# EAGLE design chiclet (EAGLE 9.6.2)

## Sheet 1 of 3
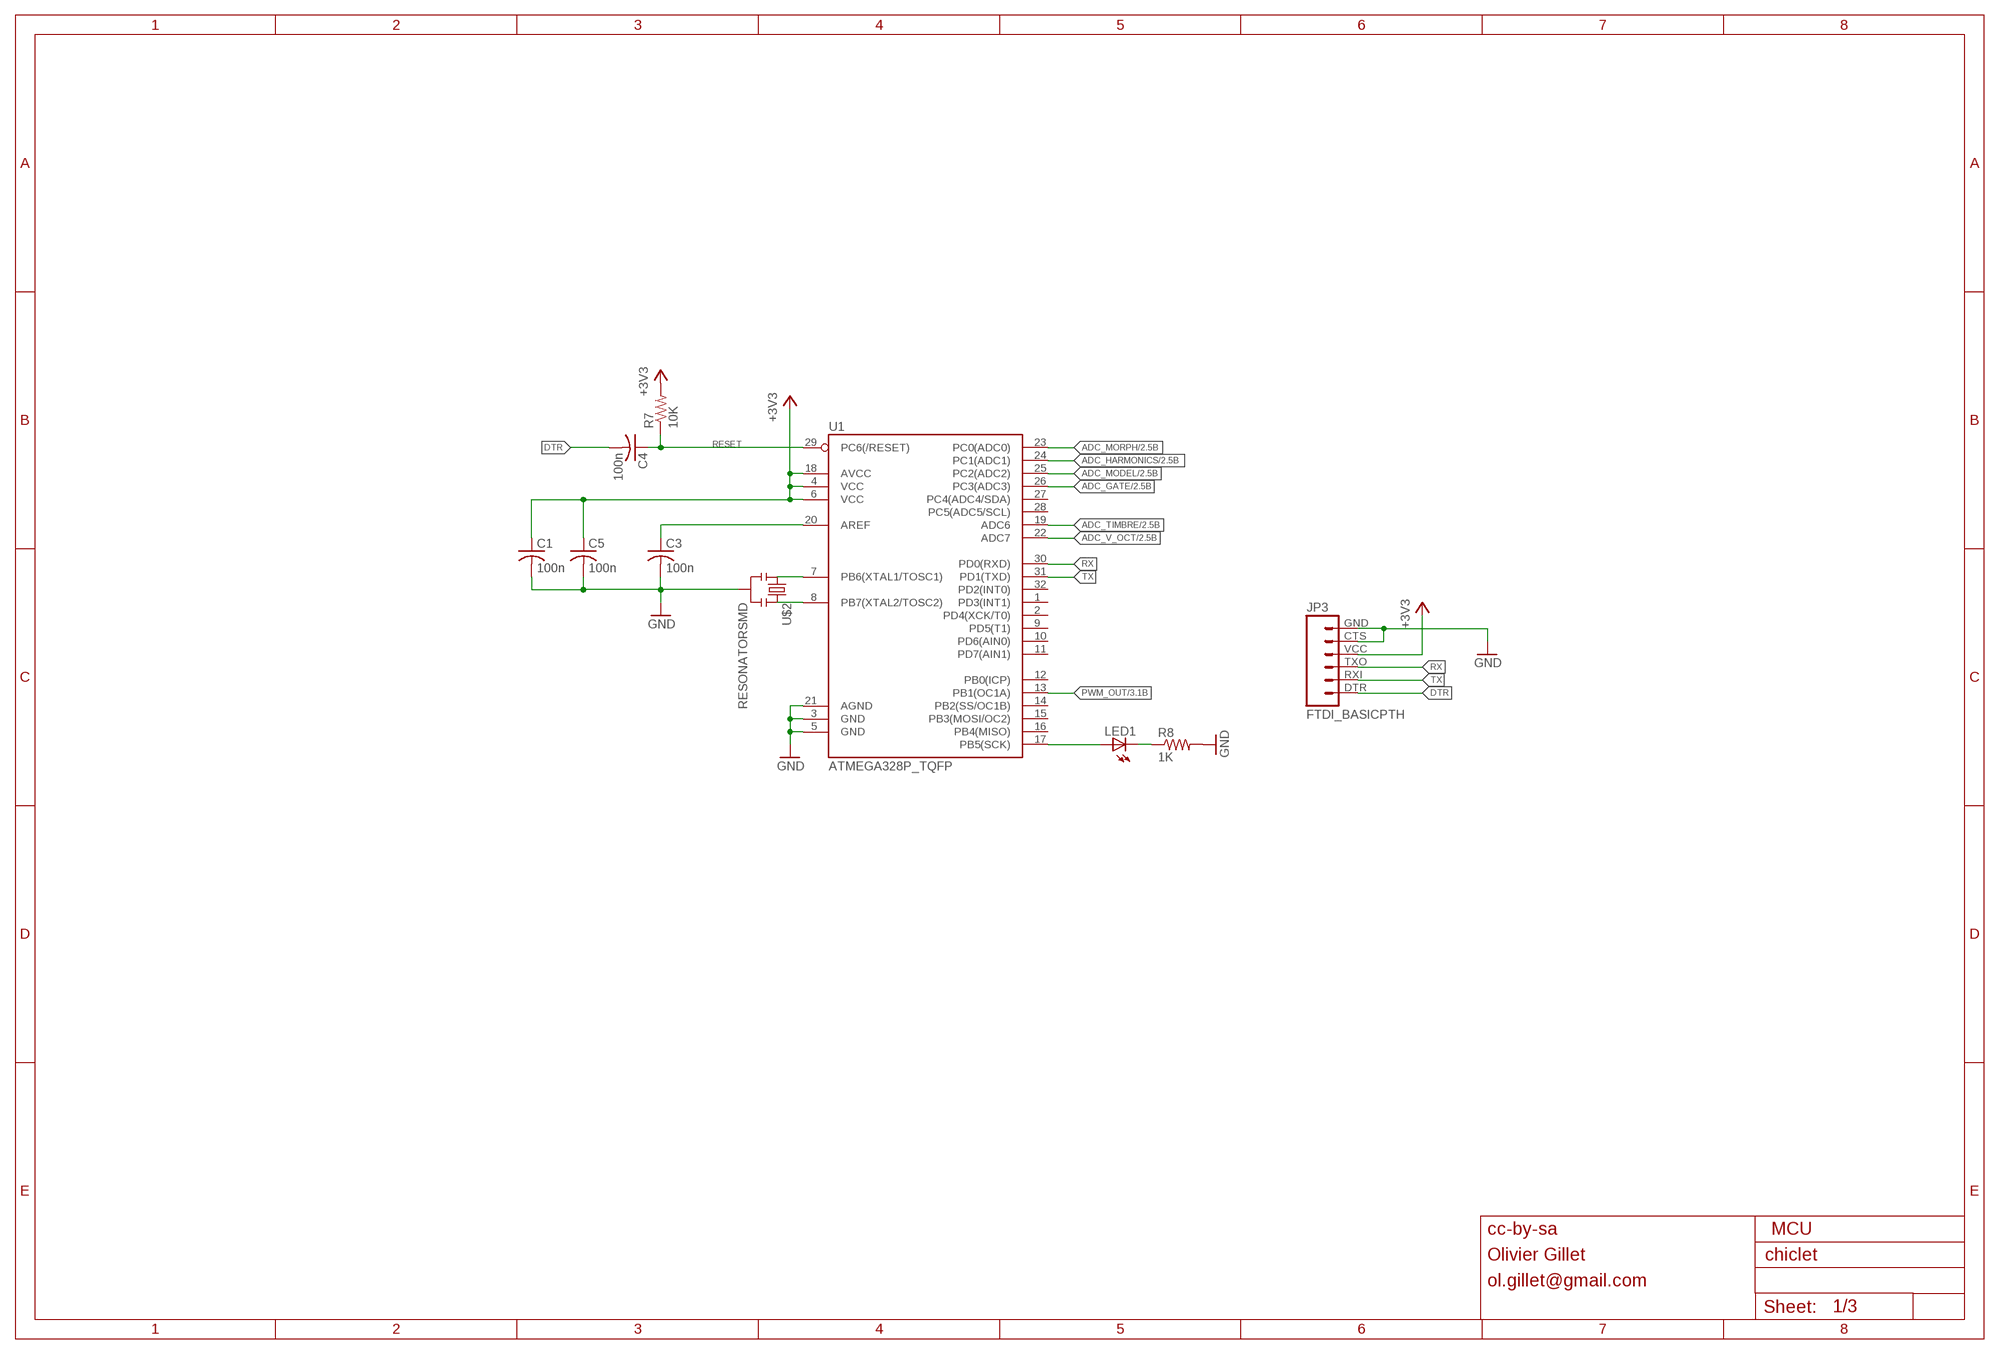
[diagram p0: schematic, sheet 1]

### Parts
C1  100n  C-USC0805  [C0805]
C3  100n  C-USC0805  [C0805]
C4  100n  C-USC0805  [C0805]
C5  100n  C-USC0805  [C0805]
JP3  FTDI_BASICPTH  [FTDI_BASIC]
LED1  LED-0805  [LED-805]
R7  10K  R-US_M0805  [M0805]
R8  1K  R-US_M0805  [M0805]
U1  ATMEGA328P_TQFP  [TQFP32-08]
U$2  RESONATORSMD  [RESONATOR-SMD]

### Nets
+3V3: C1.1 C5.1 JP3.VCC R7.2 U1.4(VCC) U1.6(VCC) U1.18(AVCC) ; also sheet 3
ADC_GATE: U1.26(PC3(ADC3)) ; also sheet 2
ADC_HARMONICS: U1.24(PC1(ADC1)) ; also sheet 2
ADC_MODEL: U1.25(PC2(ADC2)) ; also sheet 2
ADC_MORPH: U1.23(PC0(ADC0)) ; also sheet 2
ADC_TIMBRE: U1.19(ADC6) ; also sheet 2
ADC_V_OCT: U1.22(ADC7) ; also sheet 2
DTR: C4.2 JP3.DTR
GND: C1.2 C3.2 C5.2 JP3.CTS JP3.GND R8.2 U1.3(GND) U1.5(GND) U1.21(AGND) U$2.2 ; also sheet 3
N$1: U1.7(PB6(XTAL1/TOSC1)) U$2.1
N$2: U1.8(PB7(XTAL2/TOSC2)) U$2.3
N$3: C3.1 U1.20(AREF)
N$10: LED1.A U1.17(PB5(SCK))
N$12: LED1.C R8.1
PWM_OUT: U1.13(PB1(OC1A)) ; also sheet 3
RESET: C4.1 R7.1 U1.29(PC6(/RESET))
RX: JP3.TXO U1.30(PD0(RXD))
TX: JP3.RXI U1.31(PD1(TXD))
Unconnected: U1.1(PD3(INT1)) U1.2(PD4(XCK/T0)) U1.9(PD5(T1)) U1.10(PD6(AIN0)) U1.11(PD7(AIN1)) U1.12(PB0(ICP)) U1.14(PB2(SS/OC1B)) U1.15(PB3(MOSI/OC2)) U1.16(PB4(MISO)) U1.27(PC4(ADC4/SDA)) U1.28(PC5(ADC5/SCL)) U1.32(PD2(INT0))

### Notes on the sheet
- cc-by-sa | MCU
- Olivier Gillet
- ol.gillet@gmail.com

## Sheet 2 of 3
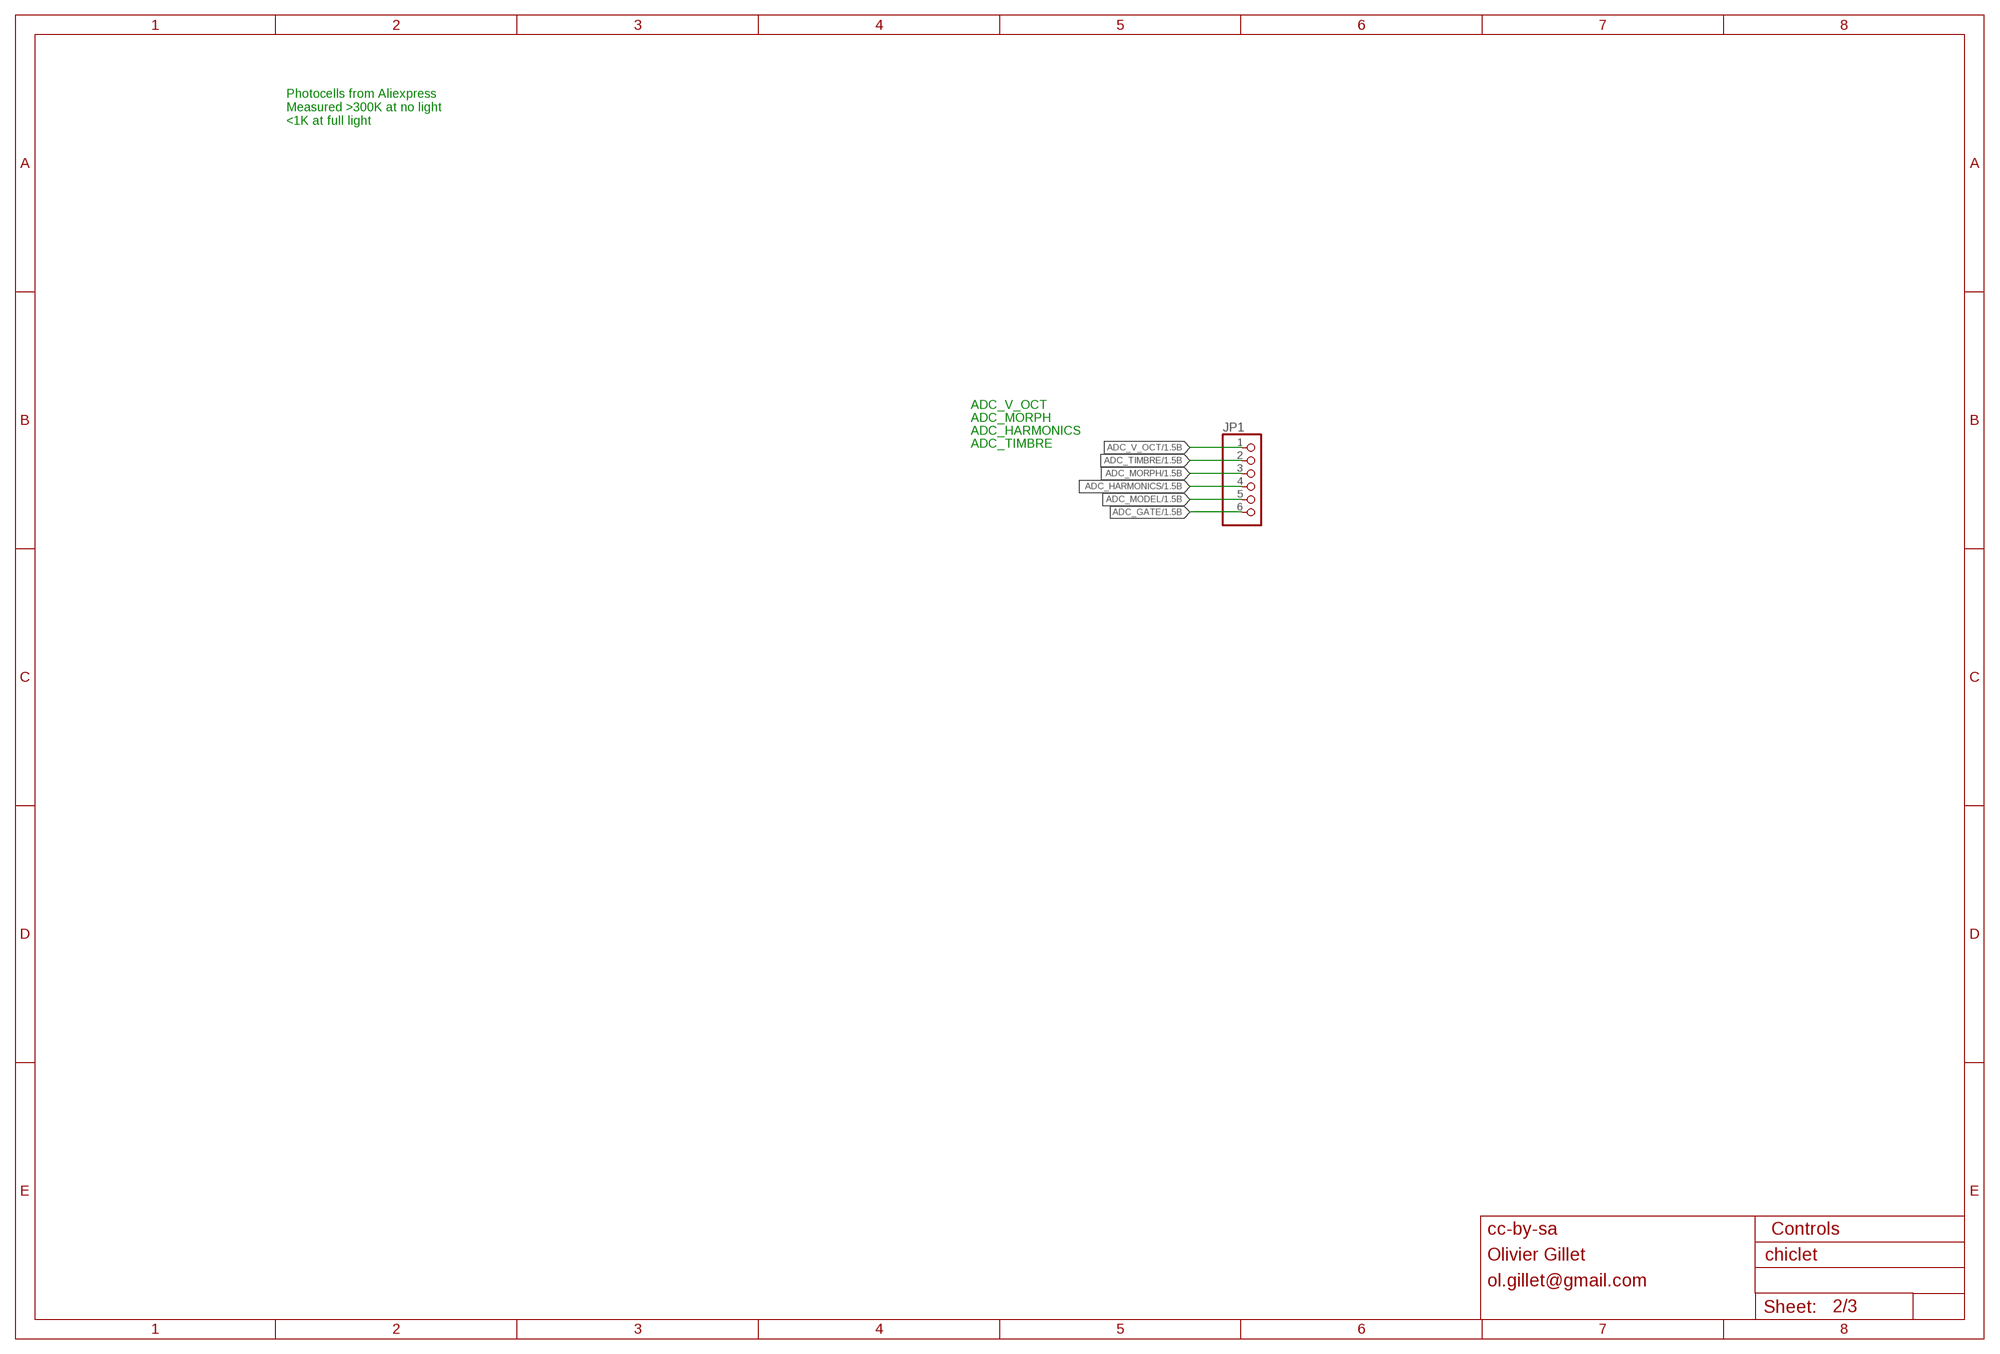
[diagram p1: schematic, sheet 2]

### Parts
JP1  PINHD-1X6  [1X06]

### Nets
ADC_GATE: JP1.6 ; also sheet 1
ADC_HARMONICS: JP1.4 ; also sheet 1
ADC_MODEL: JP1.5 ; also sheet 1
ADC_MORPH: JP1.3 ; also sheet 1
ADC_TIMBRE: JP1.2 ; also sheet 1
ADC_V_OCT: JP1.1 ; also sheet 1

### Notes on the sheet
- Photocells from Aliexpress
  Measured >300K at no light
  <1K at full light
- ADC_V_OCT
- ADC_MORPH
- ADC_HARMONICS
- ADC_TIMBRE
- cc-by-sa | Controls
- Olivier Gillet
- ol.gillet@gmail.com

## Sheet 3 of 3
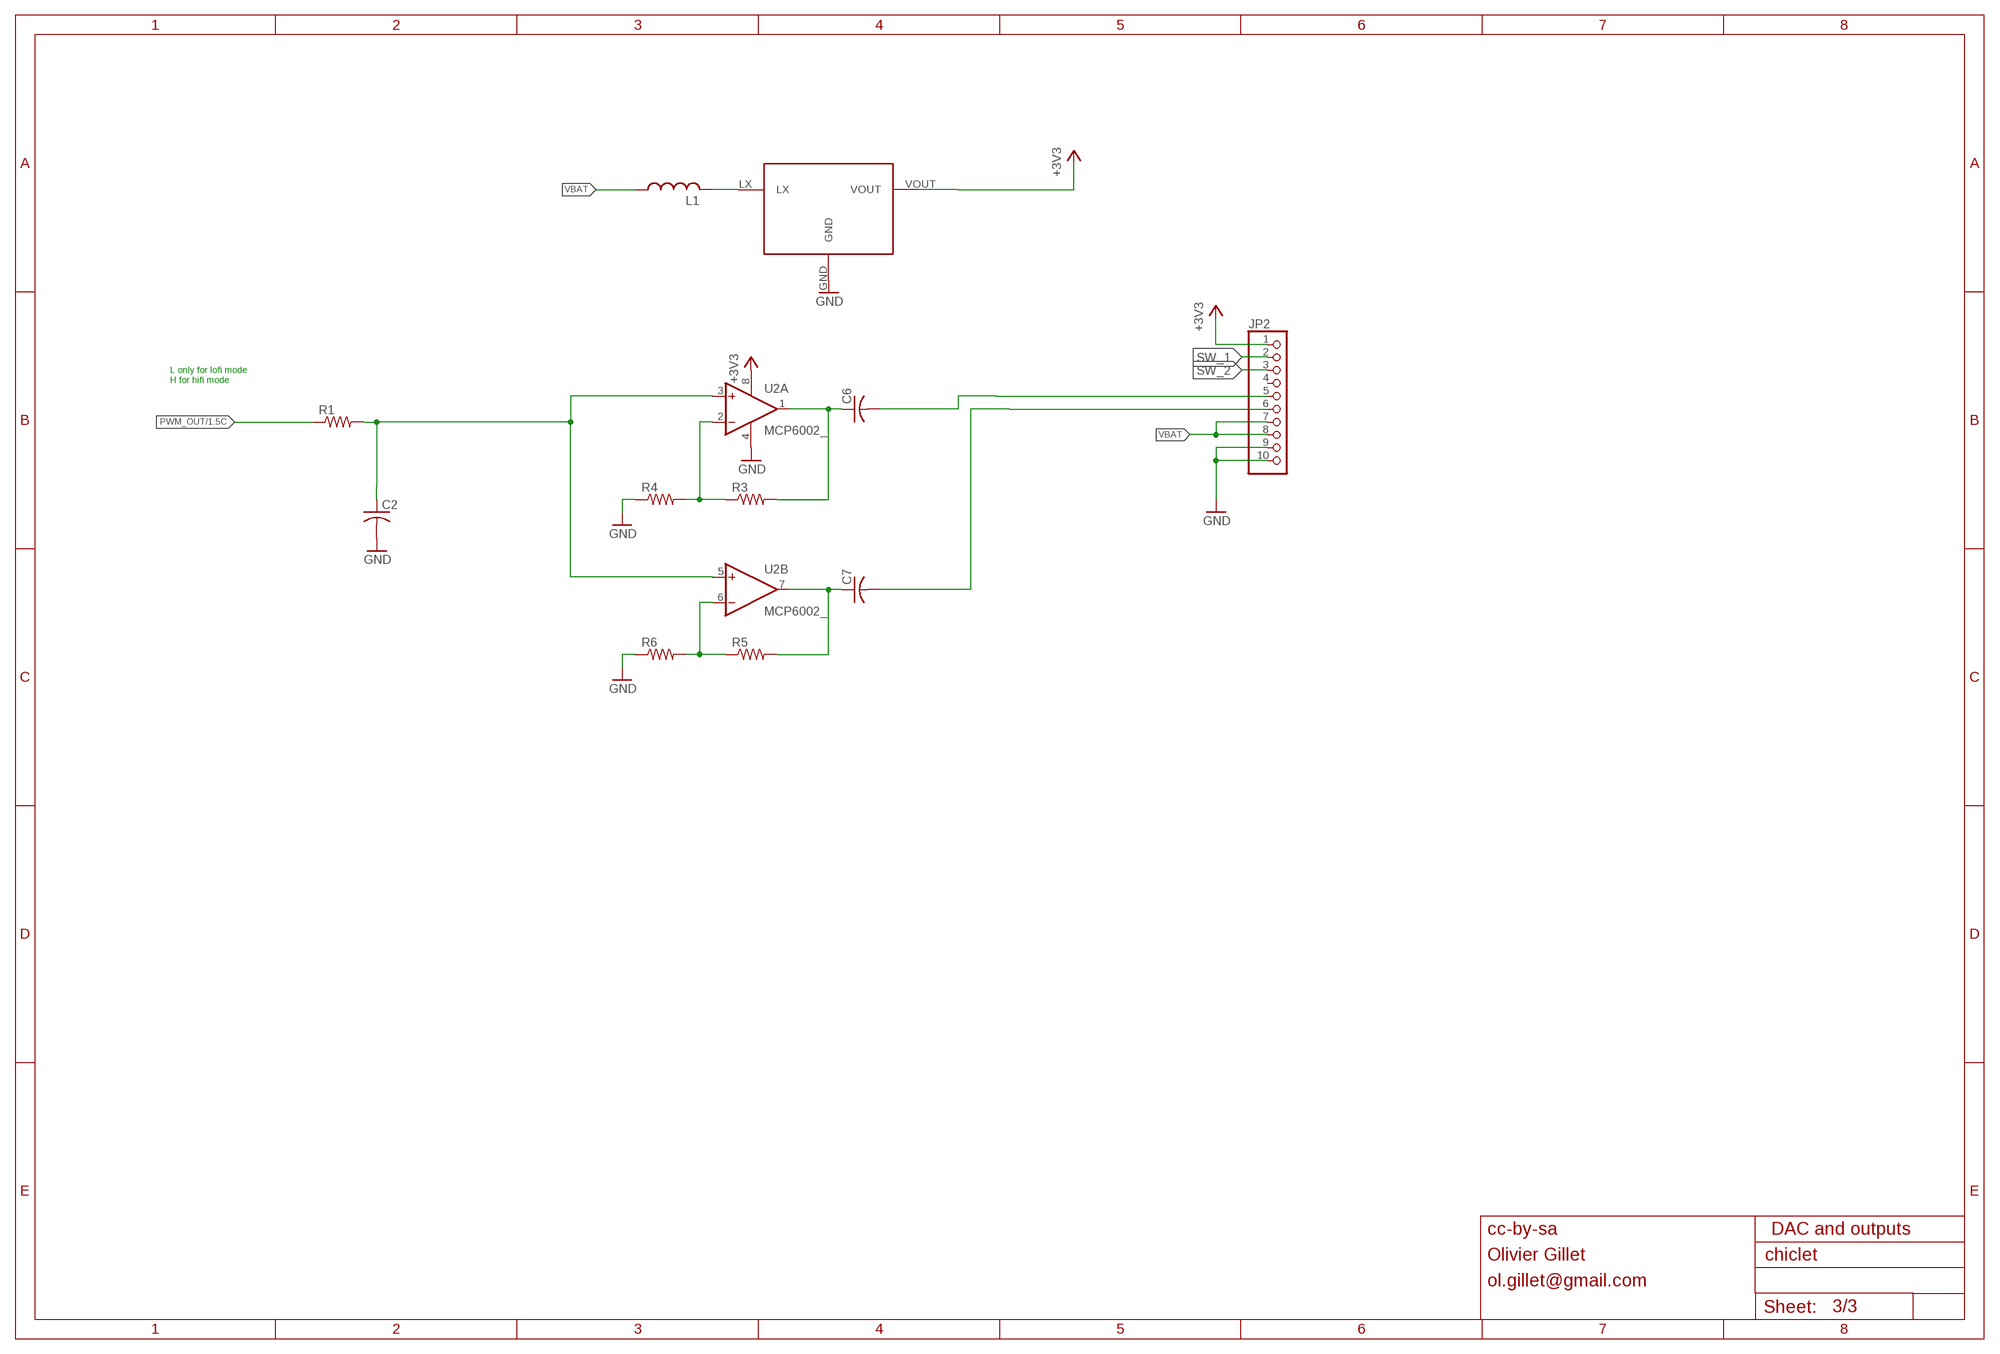
[diagram p2: schematic, sheet 3]

### Parts
C2  C-USC0805  [C0805]
C6  C-USC0805  [C0805]
C7  C-USC0805  [C0805]
JP2  PINHD-1X10  [1X10]
L1  L-USL2825P  [L2825P]
R1  R-US_R0805  [R0805]
R3  R-US_R0805  [R0805]
R4  R-US_R0805  [R0805]
R5  R-US_R0805  [R0805]
R6  R-US_R0805  [R0805]
U2  MCP6002_  [SO08]
U$1  QX2304L33E  [SOT89-R]

### Nets
+3V3: JP2.1 U2.8(P:V+) U$1.VOUT ; also sheet 1
GND: C2.2 JP2.9 JP2.10 R4.1 R6.1 U2.4(P:V-) U$1.GND ; also sheet 1
N$4: L1.2 U$1.LX
N$5: C2.1 R1.2 U2.3(A:+IN) U2.5(B:+IN)
N$9: C6.2 JP2.5
N$11: C7.2 JP2.6
N$14: R3.1 R4.2 U2.2(A:-IN)
N$16: R5.1 R6.2 U2.6(B:-IN)
N$18: C7.1 R5.2 U2.7(B:OUT)
N$19: C6.1 R3.2 U2.1(A:OUT)
PWM_OUT: R1.1 ; also sheet 1
SW_1: JP2.2
SW_2: JP2.3
VBAT: JP2.7 JP2.8 L1.1
Unconnected: JP2.4

### Notes on the sheet
- L only for lofi mode
  H for hifi mode
- cc-by-sa | DAC and outputs
- Olivier Gillet
- ol.gillet@gmail.com

## Library data of the parts
C1-C7 = rcl:C-US: CAPACITOR, American symbol; SPICEPREFIX: C
JP1 = pinhead:PINHD-1X6: PIN HEADER
JP2 = pinhead:PINHD-1X10: PIN HEADER
JP3 = SparkFun-Connectors:FTDI_BASIC: FTDI Basic header with labels
L1 = rcl:L-US: INDUCTOR, American symbol; SPICEPREFIX: L
LED1 = dp_devices:LED: Light Emitting Diode
R1 R3-R8 = rcl:R-US_: RESISTOR, American symbol; SPICEPREFIX: R
U1 = SparkFun-IC-Microcontroller:ATMEGA328P_TQFP: Popular 328P in QFP Storefront component: ATmega328 - TQFP <https://www.sparkfun.com/products/13448> (COM-13448) Datasheet <http://www.sparkfun.com/datasheets/Components/SMD/ATMega328.pdf> SparkFun Products SparkFun RedBoard - Programmed with Arduino <https://www.sparkfun.com/products/12757> (DEV-12757) Arduino Pro Mini 328 - 5V/16MHz <https://www.sparkfun.com/products/11113> (DEV-11113) Arduino Pro Mini 328 - 3.3V/8MHz <https://www.sparkfun.com/products/11114> (DEV-11114) SparkFun OpenLog <https://www.sparkfun.com/products/13712> (DEV-13712) SparkFun MicroView - OLED Arduino Module <https://www.sparkfun.com/products/12923> (DEV-12923) SparkFun Digital Sandbox <https://www.sparkfun.com/products/12651> (DEV-12651) SparkFun PicoBoard <https://www.sparkfun.com/products/11888> (WIG-11888) Arduino Fio <https://www.sparkfun.com/products/10116> (DEV-10116) LilyPad Arduino 328 Main Board <https://www.sparkfun.com/products/13342> (DEV-13342) SparkFun RedStick <https://www.sparkfun.com/products/13741> (DEV-13741) LilyPad MP3 <https://www.sparkfun.com/products/11013> (DEV-11013) LilyPad Arduino SimpleSnap <https://www.sparkfun.com/products/10941> (DEV-10941) SparkFun Stepoko <https://www.sparkfun.com/products/13899> (ROB-13899) SparkFun Geiger Counter <https://www.sparkfun.com/products/11345> (SEN-11345) SparkFun EL Sequencer <https://www.sparkfun.com/products/12781> (COM-12781) Arduino Pro 328 - 5V/16MHz <https://www.sparkfun.com/products/10915> (DEV-10915) CryptoCape <https://www.sparkfun.com/products/12773> (DEV-12773) SparkFun IR Thermometer Evaluation Board - MLX90614 <https://www.sparkfun.com/products/10740> (SEN-10740) SparkFun RedBot Mainboard <https://www.sparkfun.com/products/12097> (ROB-12097) Arduino Pro 328 - 3.3V/8MHz <https://www.sparkfun.com/products/10914> (DEV-10914) SparkFun Block for Intel® Edison - Arduino <https://www.sparkfun.com/products/13036> (DEV-13036) SparkFun Simon Says - Surface Mount Soldering Kit <https://www.sparkfun.com/products/10935> (KIT-10935) SparkFun 7-Segment Serial Display - Red <https://www.sparkfun.com/products/11441> (COM-11441) SparkFun 7-Segment Serial Display - White <https://www.sparkfun.com/products/11629> (COM-11629) SparkFun 7-Segment Serial Display - Yellow <https://www.sparkfun.com/products/11443> (COM-11443) SparkFun 7-Segment Serial Display - Kelly Green <https://www.sparkfun.com/products/11440> (COM-11440) SparkFun 7-Segment Serial Display - Blue <https://www.sparkfun.com/products/11442> (COM-11442) SparkFun OpenSegment Serial Display - 20mm (Blue) <https://www.sparkfun.com/products/11647> (COM-11647) SparkFun OpenSegment Serial Display - 20mm (Green) <https://www.sparkfun.com/products/11646> (COM-11646) SparkFun OpenSegment Serial Display - 20mm (White) <https://www.sparkfun.com/products/11648> (COM-11648) SparkFun OpenSegment Serial Display - 20mm (Red) <https://www.sparkfun.com/products/11644> (COM-11644) SparkFun OpenSegment Serial Display - 20mm (Yellow) <https://www.sparkfun.com/products/11645> (COM-11645) SparkFun OpenSegment Shield <https://www.sparkfun.com/products/13190> (DEV-13190); PROD_ID: IC-09069
U2 = MusicThingModular:MCP6002: Generic Dual Op Amp
U$1 = ptrz:QX2304L33E
U$2 = SparkFun-3-2-07:RESONATOR: Resonator Small SMD resonator. This is the itty bitty 10/20MHz resonators with built in caps. CSTCE10M0G55 and CSTCE20M0V53. Footprint has been reviewed closely but hasn't been tested yet.

## Net classes
0 default: width 0.178 mm, drill 0.305 mm, clearance 0.254 mm

## Board
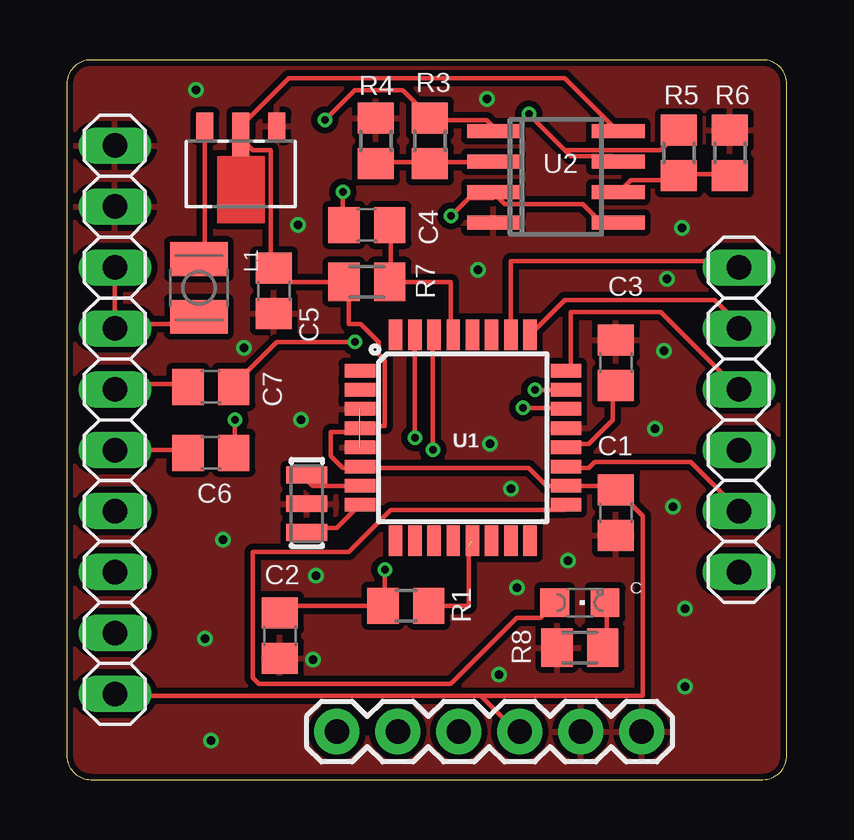
[diagram p3: board, top side]
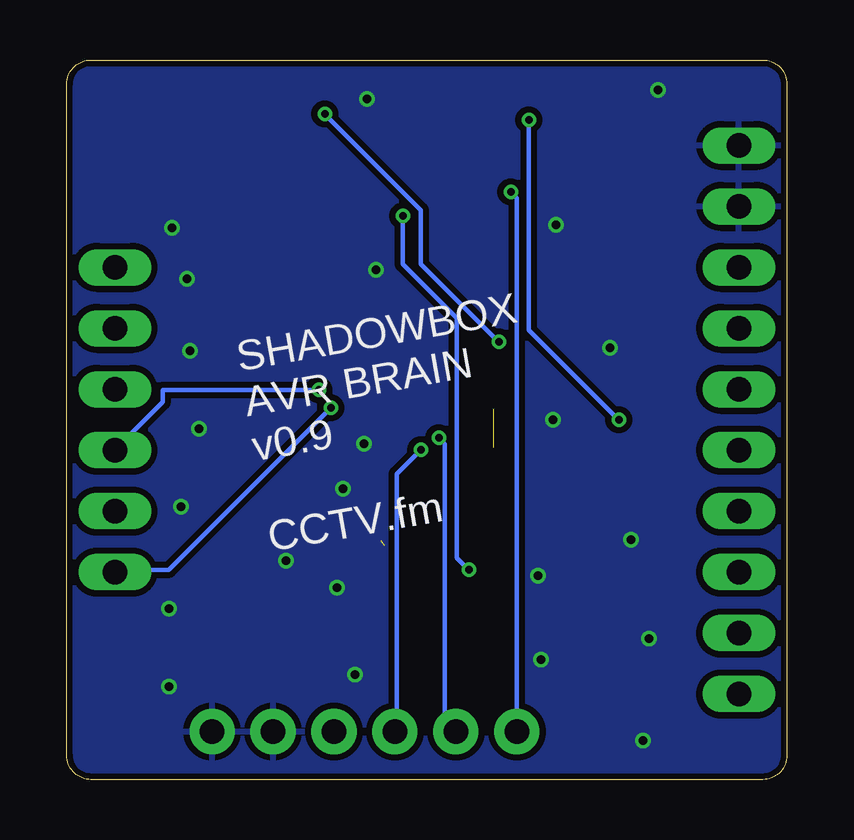
[diagram p4: board, bottom side, seen from below]

Size 30 x 30 mm. Coordinates in mm from the lower left corner, seen from the top.
Outline: 1,0 29,0 arc90 30,1 30,29 arc90 29,30 1,30 arc90 0,29 0,1 arc90 1,0
Copper layers (1*16): Top 0.035mm / dielectric 1.5mm / Bottom 0.035mm
Design rules "dirt_cheap_dirty_boards.v1": minimum track width 5mil, minimum drill 12mil, track to track 5mil, track to pad 5mil, pad to pad 5mil, via to via 5mil, smd to smd 0mil, copper to edge 10mil, drill to drill 10mil, minimum pad ring 10mil, minimum via ring 6mil, stop-mask expansion 2mil, vias tented up to drill 25mil, thermal gap 10mil

### Footprints (pad centres in the part's own frame; a part is rotated, then mirrored left to right if it is on the bottom)
C0805 = smd 1.3 x 1.5: 1 -0.95,0; 2 0.95,0
1X06 = drill 1.016 long: 1 -6.35,0; 2 -3.81,0; 3 -1.27,0; 4 1.27,0; 5 3.81,0; 6 6.35,0
1X10 = drill 1.016 long: 1 -11.43,0; 2 -8.89,0; 3 -6.35,0; 4 -3.81,0; 5 -1.27,0; 6 1.27,0; 7 3.81,0; 8 6.35,0; 9 8.89,0; 10 11.43,0
FTDI_BASIC = drill 1.016 pad 1.88: CTS 10.16,0; DTR 0,0; GND 12.7,0; RXI 2.54,0; TXO 5.08,0; VCC 7.62,0
L2825P = smd 1.4 x 2.4: 1 -1.2,0; 2 1.2,0
LED-805 = smd 1.2 x 1.2: A 0,-1.05; C 0,1.05
R0805 = smd 1.3 x 1.5: 1 -0.95,0; 2 0.95,0
M0805 = smd 1.3 x 1.6: 1 -0.95,0; 2 0.95,0
TQFP32-08 = smd 1.27 x 0.559: 1 -4.293,2.8; 2 -4.293,2; 3 -4.293,1.2; 4 -4.293,0.4; 5 -4.293,-0.4; 6 -4.293,-1.2; 7 -4.293,-2; 8 -4.293,-2.8; 17 4.293,-2.8; 18 4.293,-2; 19 4.293,-1.2; 20 4.293,-0.4; 21 4.293,0.4; 22 4.293,1.2; 23 4.293,2; 24 4.293,2.8 | smd 0.559 x 1.27: 9 -2.8,-4.293; 10 -2,-4.293; 11 -1.2,-4.293; 12 -0.4,-4.293; 13 0.4,-4.293; 14 1.2,-4.293; 15 2,-4.293; 16 2.8,-4.293; 25 2.8,4.293; 26 2,4.293; 27 1.2,4.293; 28 0.4,4.293; 29 -0.4,4.293; 30 -1.2,4.293; 31 -2,4.293; 32 -2.8,4.293
SO08 = smd 0.6 x 2.2: 1 -1.905,-2.6; 2 -0.635,-2.6; 3 0.635,-2.6; 4 1.905,-2.6; 5 1.905,2.6; 6 0.635,2.6; 7 -0.635,2.6; 8 -1.905,2.6
SOT89-R = smd 0.7 x 1.1: GND -1.5,-1.75; LX 1.5,-1.75 | smd 0.7 x 1.8: VOUT 0,-1.4
RESONATOR-SMD = smd 0.7 x 1.7: 1 -1.2,0; 2 0,0; 3 1.2,0

### Placement (x,y rotation side)
C1  22.88,11.12 270 top
C2  8.88,6 270 top
C3  22.88,17.38 90 top
C4  12.5,23.12 180 top
C5  8.62,20.38 270 top
C6  6,13.62 180 top
C7  6,16.38 180 top
JP1  28,15 90 top
JP2  2,15 90 top
JP3  11.25,2 0 top
L1  5.5,20.5 90 top
LED1  21.38,7.38 270 top
R1  14.12,7.25 180 top
R3  15.12,26.62 90 top
R4  12.88,26.62 270 top
R5  25.5,26.12 90 top
R6  27.62,26.12 270 top
R7  12.5,20.75 180 top
R8  21.38,5.5 180 top
U1  16.5,14.25 0 top
U2  20.38,25.12 270 top
U$1  7.25,25.5 180 top
U$2  10,11.5 270 top

### Tracks (layer width: path | path; a pad name or v marks a point on that pad's centre or on a via)
+3V3
  Top 0.178: U2.8 22.75,27.25 20.75,29.25 9.25,29.25 7.25,27.25 7.25,27 U$1.VOUT 7.25,26.75 7.75,26.25 8.5,26.25 8.5,21.5 C5.1 8.75,21.25 9.25,20.75 11.5,20.75 R7.2 11.75,20.75 11.75,19 12.25,19 13,18.25 13,17.75 13.25,17.5 13.25,14.75 12.25,14.75 U1.4 12,14.5 11,14.5 11,13.5 11.5,13 12,13 U1.6 12.25,13 19.25,13 20,12.25 20.75,12.25 U1.18 21,12.25 22.75,12.25 C1.1 23,12 24,11 24,3.5 17.25,3.5 | 17.25,3.5 2,3.5 JP2.1 | 17.25,3.5 18.75,2 JP3.VCC
ADC_GATE
  Top 0.178: JP1.6 27.73,21.62 18.5,21.62 18.5,18.75 U1.26
ADC_HARMONICS
  Top 0.178: U1.24 21,17.25 21,19.5 24.75,19.5 27.75,16.5 28,16.5 JP1.4
ADC_MODEL
  Top 0.178: U1.25 19.5,18.75 20.75,20 27,20 28,19 JP1.5
ADC_MORPH  (via drill 0.3)
  Top 0.178: v19.5,16.25 20.75,16.25 U1.23
  Bottom 0.178: v19.5,16.25 26,16.25 26,15.75 28,13.75 JP1.3
ADC_TIMBRE
  Top 0.178: U1.19 21,13 21.75,13 22,13.25 26,13.25 28,11.25 JP1.2
ADC_V_OCT  (via drill 0.3)
  Top 0.178: v19,15.5 20.75,15.5 U1.22
  Bottom 0.178: v19,15.5 25.75,8.75 28,8.75 JP1.1
DTR  (via drill 0.3)
  Top 0.178: v11.5,24.5 11.5,23.25 C4.2
  Bottom 0.178: v11.5,24.5 11.25,24.25 JP3.DTR
GND  (via drill 0.35)  (1 unrouted)
  other vias: 7.38,18 9.75,15 6.5,10 10.38,8.5 10.25,5 18,4.38 25.75,3.88 20.88,9.12 18.5,12.12 17.62,14 24.5,14.62 24.88,17.88 25,20.88 25.62,23 17.12,21.25 17.5,28.38 5.38,28.75 9.62,23.12 5.75,5.88 6,1.62 25.75,7.12 25.25,11.38 18.75,8
  pour Top: 30,29 30,1 arc-90 29,0 1,0 arc-90 0,1 0,29 arc-90 1,30 29,30 arc-90
  pour Bottom: 30,29 30,1 arc-90 29,0 1,0 arc-90 0,1 0,29 arc-90 1,30 29,30 arc-90
N$1
  Top 0.178: U1.7 12,12.25 10.25,12.25 10,12.5 U$2.1
N$2
  Top 0.178: U1.8 12,11.25 11.25,10.5 10,10.5 U$2.3
N$3
  Top 0.178: U1.20 21,14 21.75,14 22.75,15 22.75,16.25 C3.1
N$4
  Top 0.178: U$1.LX 5.75,21.75 5.5,21.75 L1.2
N$5  (via drill 0.3)
  Top 0.178: C2.1 9,7 9.25,7.25 13,7.25 R1.2 | 13.25,7.25 R1.2 | U2.5 22.75,23.25 22.25,23.25 21.5,24 18.25,24 18,24.25 U2.3 17.75,24.25 16.75,24.25 v16,23.5 | v13.25,8.75 13.25,7.25 | 13.25,7.25 R1.2
  Bottom 0.178: v13.25,8.75 13.75,9.25 13.75,19.25 16,21.5 v16,23.5
N$9
  Top 0.178: C6.2 5,13.75 2,13.75 JP2.5
N$10
  Top 0.178: LED1.A 20.25,7.25 19.75,6.75 18.75,6.75 16,4 8,4 7.75,4.25 7.75,9.5 11.75,9.5 13.5,11.25 20.75,11.25 U1.17
N$11
  Top 0.178: C7.2 5,16.5 2,16.5 JP2.6
N$12
  Top 0.178: LED1.C 22.5,7.25 22.5,5.5 R8.1
N$14
  Top 0.178: R4.2 13,25.75 15,25.75 R3.1 15.25,25.75 17.75,25.75 U2.2
N$16
  Top 0.178: R6.2 27.5,25.25 25.5,25.25 R5.1 25.5,25 23.5,25 23,24.5 U2.6
N$18  (via drill 0.3)
  Top 0.178: v12,18.25 8.75,18.25 7,16.5 C7.1 | 20.75,26.25 21,26 22.75,26 U2.7 | 20.75,26.25 v19.25,27.75 | 20.75,26.25 24.75,26.25 25.5,27 R5.2
  Bottom 0.178: v12,18.25 15.25,21.5 15.25,23.75 v19.25,27.75
N$19  (via drill 0.3)
  Top 0.178: v7,15 7,13.75 C6.1 | v10.75,27.5 12,28.75 14,28.75 15,27.75 R3.2 15.25,27.5 17.5,27.5 17.75,27.25 U2.1
  Bottom 0.178: v7,15 10.75,18.75 v10.75,27.5
PWM_OUT  (1 unrouted)
  Top 0.178: 16.75,9.75 16.75,7.25 15.25,7.25 R1.1
RESET
  Top 0.178: 13.5,20.75 16,20.75 16,18.75 U1.29 | 13.5,20.75 R7.1 13.5,20.75 | 13.5,20.75 13.5,23 C4.1
RX  (via drill 0.3)
  Top 0.178: v15.25,13.75 15.25,18.5 U1.30
  Bottom 0.178: v15.25,13.75 16.25,12.75 16.25,2 JP3.TXO
TX  (via drill 0.3)
  Top 0.178: v14.5,14.25 14.5,18.5 U1.31
  Bottom 0.178: v14.5,14.25 14.25,14 14.25,2.25 14,2 JP3.RXI
VBAT
  Top 0.178: 2,19 5.25,19 5.5,19.25 L1.1 | 2,19 JP2.7 2,19 | 2,19 2,21.25 JP2.8

### Text on the board
tNames: C
bNames: SHADOWBOX / AVR BRAIN / v0.9 / / CCTV.fm
tDocu: ENV / MODEL / HARMONICS / MORPH / TIMBRE / PITCH | GND / GND / VBAT / VBAT / OUTR / OUTL / N/C / SW2? / SW1? / 3V3